# EAGLE design lcd1616 (EAGLE 5.11)
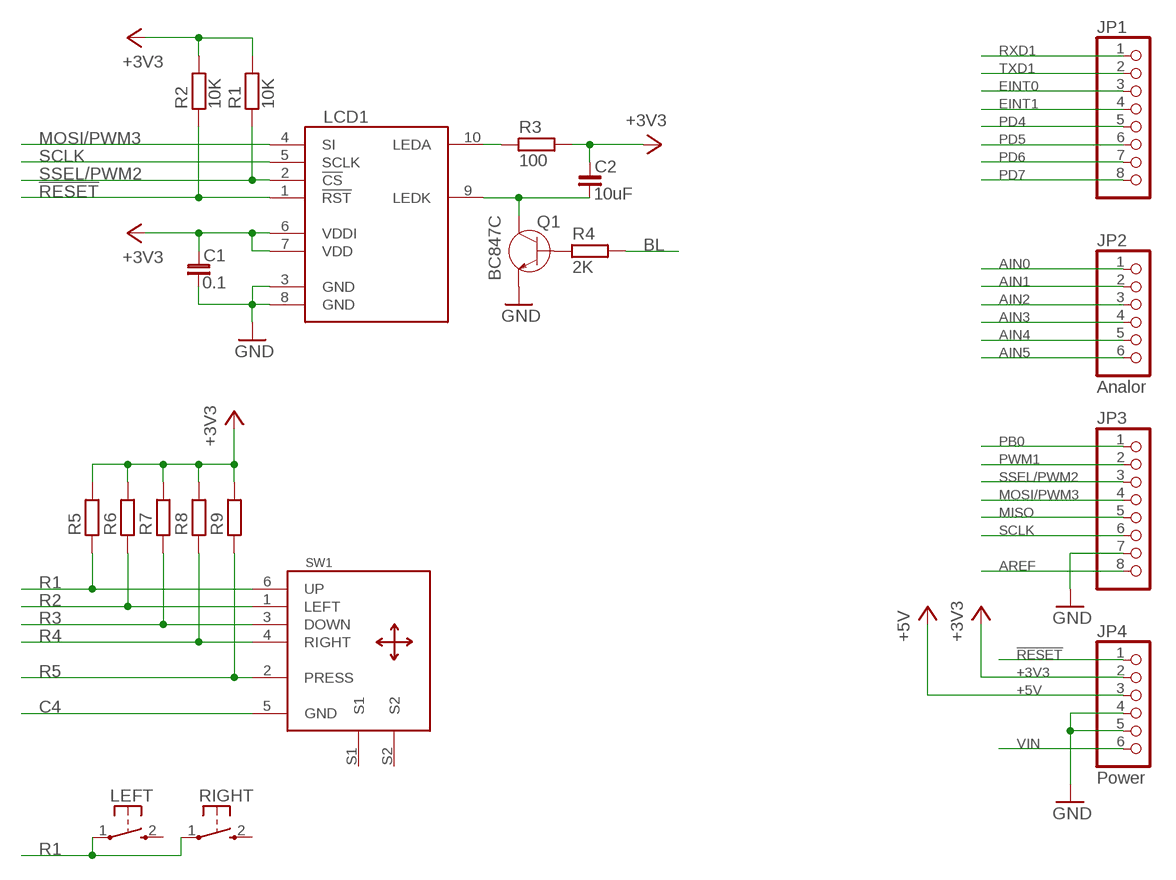
[diagram p0: schematic, sheet 1]

## Parts
C1  0.1  C_0603  [C0603]
C2  10uF  C_0805  [C0805]
JP1  PINHD-1X8_2.54  [1X08]
JP2  Analor  PINHD-1X6_2.54  [1X06]
JP3  PINHD-1X8_2.54  [1X08]
JP4  Power  PINHD-1X6_2.54  [1X06]
LCD1  NOKIA_LCD_1616  [NOKIA1616LCD]
LEFT  KSS-2EG4430  [KSS-2EG4430]
Q1  BC847C  [SOT23]
R1  10K  R_0603  [R0603]
R2  10K  R_0603  [R0603]
R3  100  R_0603  [R0603]
R4  2K  R_0603  [R0603]
R5  4.7K  R_0603  [R0603]
R6  4.7K  R_0603  [R0603]
R7  4.7K  R_0603  [R0603]
R8  4.7K  R_0603  [R0603]
R9  4.7K  R_0603  [R0603]
RIGHT  KSS-2EG4430  [KSS-2EG4430]
SW1  NOKIA-JOY  [NOKIA_JOY]

## Nets
!RESET: JP4.1 LCD1.1(!RST) R2.1
+3V3: C1.1 C2.1 JP4.2 LCD1.6(VDDI) LCD1.7(VDD) R1.2 R2.2 R3.2 R5.2 R6.2 R7.2 R8.2 R9.2
+5V: JP4.3
AIN0: JP2.1
AIN1: JP2.2
AIN2: JP2.3
AIN3: JP2.4
AIN4: JP2.5
AIN5: JP2.6
AREF: JP3.8
BL: R4.2
C4: SW1.5(GND)
EINT0: JP1.3
EINT1: JP1.4
GND: C1.2 JP3.7 JP4.4 JP4.5 LCD1.3(GND) LCD1.8(GND) Q1.2(E)
MISO: JP3.5
MOSI/PWM3: JP3.4 LCD1.4(SI)
N$7: C2.2 LCD1.9(LEDK) Q1.3(C)
N$8: LCD1.10(LEDA) R3.1
N$9: Q1.1(B) R4.1
PB0: JP3.1
PD4: JP1.5
PD5: JP1.6
PD6: JP1.7
PD7: JP1.8
PWM1: JP3.2
R1: LEFT.1(P) R5.1 RIGHT.1(P) SW1.6(UP)
R2: R6.1 SW1.1(LEFT)
R3: R7.1 SW1.3(DOWN)
R4: R8.1 SW1.4(RIGHT)
R5: R9.1 SW1.2(PRESS)
RXD1: JP1.1
SCLK: JP3.6 LCD1.5(SCLK)
SSEL/PWM2: JP3.3 LCD1.2(!CS) R1.1
TXD1: JP1.2
VIN: JP4.6
Unconnected: LEFT.2(S) RIGHT.2(S) SW1.S1 SW1.S2

## Library data of the parts
C1 C2 = rc-master-smd:C_: NON-POLARIZED CAP
JP1 JP3 = pinhead-fixdrills:PINHD-1X8: PIN HEADER
JP2 JP4 = pinhead-fixdrills:PINHD-1X6: PIN HEADER
LCD1 = nokia_lcd:NOKIA_LCD: 1.3" b/w graphics display 96x68 pixel. From Nokia 1202 cell phone 1.8" color graphics display 128x160 pixel. From Nokia 1616 cell phone
LEFT RIGHT = buttons:KSS-2EG4430: Size: 3x6mm Height: 5mm from PCB Rating: DC12v 50mA Travel: 0.25±0.10mm Operating Force: 180±50gf Return Force: 60gf min Contact resistance: 100m? max Insulation resistance: 100M? min Operating life?50,000 cycles
Q1 = semiconductor:BC847: Bipolar transistor NPN-structure
R1-R9 = rc-master-smd:R_: RESISTOR
SW1 = buttons:NOKIA-JOY: Nokia 3250/6820/N73 Joystick

## Board
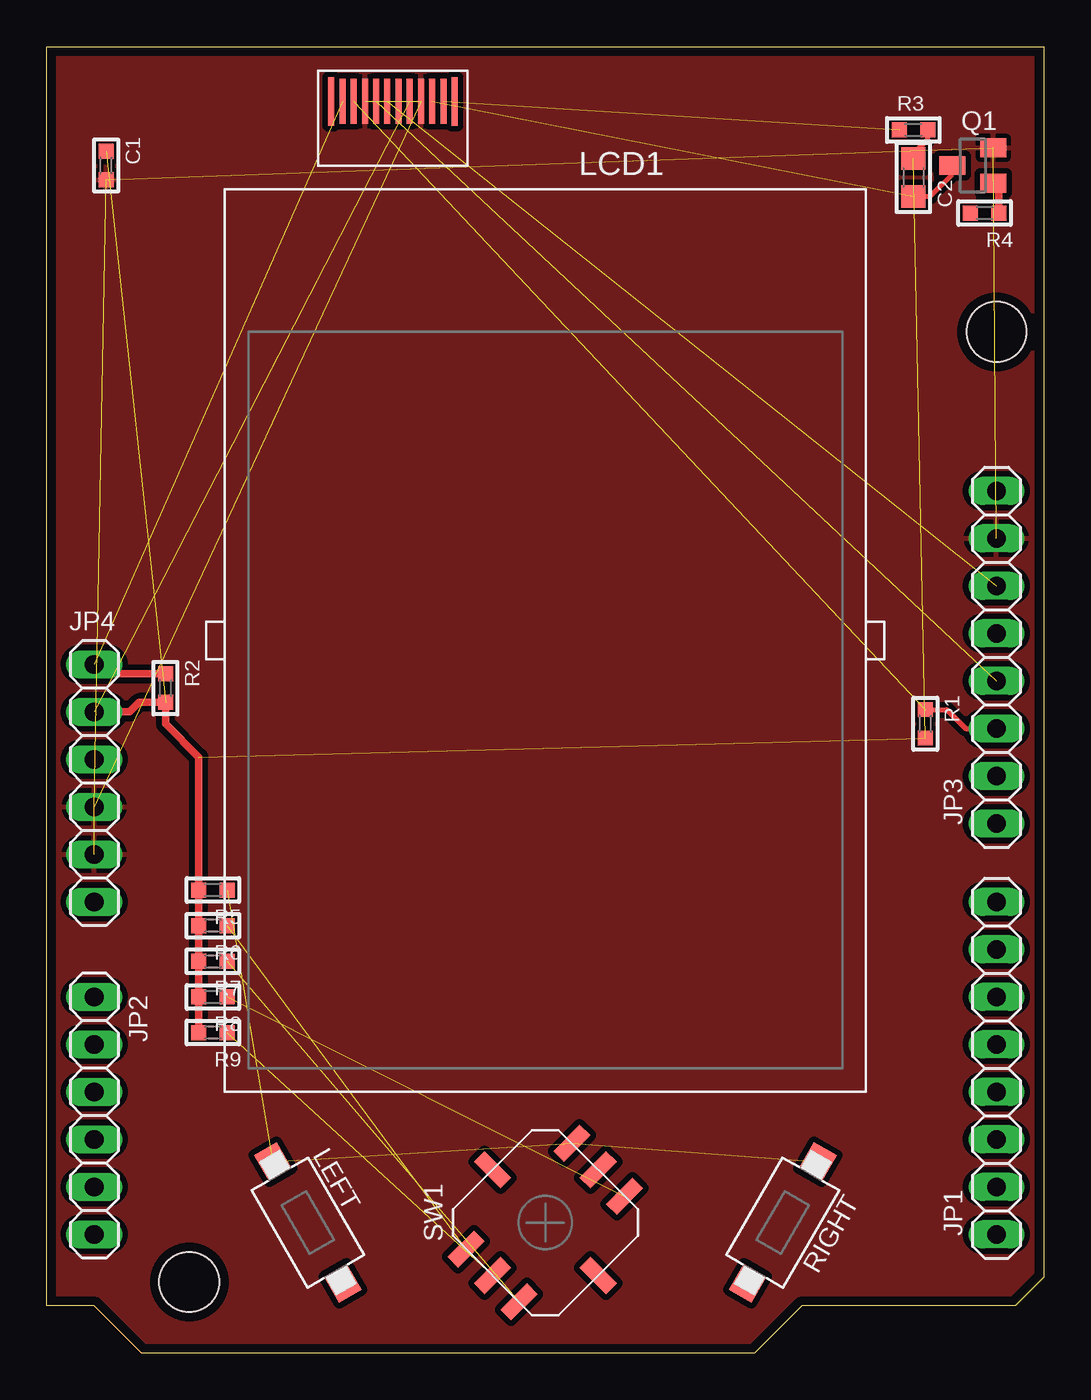
[diagram p1: board, top side]

Size 53.34 x 69.85 mm. Coordinates in mm from the lower left corner, seen from the top.
Outline: 53.34,69.85 53.34,4.06 51.82,2.54 40.39,2.54 37.85,0 5.08,0 2.54,2.54 0,2.54 0,69.85 53.34,69.85
Copper layers (1*16): Top 0.018mm / dielectric 1.5011mm / Bottom 0.018mm
Design rules "resonit-speed-18um": minimum track width 0.15mm, minimum drill 0.4mm, track to track 0.15mm, track to pad 0.15mm, pad to pad 0.15mm, via to via 0.15mm, smd to smd 0.15mm, copper to edge 0.5mm, drill to drill 8mil, minimum pad ring 0.25mm, minimum via ring 0.25mm, stop-mask expansion 4mil, vias tented up to drill 0.6mm, thermal gap 10mil
Holes 3.2 mm at 7.62,3.81 50.8,54.61

### Footprints (pad centres in the part's own frame; a part is rotated, then mirrored left to right if it is on the bottom)
C0603 = smd 0.8 x 0.8: 1 -0.762,0; 2 0.762,0
C0805 = smd 1.2 x 1.3: 1 -1.016,0; 2 1.016,0
1X08 = drill 1 long: 1 -8.89,0; 2 -6.35,0; 3 -3.81,0; 4 -1.27,0; 5 1.27,0; 6 3.81,0; 7 6.35,0; 8 8.89,0
1X06 = drill 1 long: 1 -6.35,0; 2 -3.81,0; 3 -1.27,0; 4 1.27,0; 5 3.81,0; 6 6.35,0
NOKIA1616LCD = smd 0.32 x 2.6: 0 -11.455,28.829; 11 -4.855,28.829 | smd 0.32 x 2.4: 1 -10.855,28.829; 2 -10.255,28.829; 3 -9.655,28.829; 4 -9.055,28.829; 5 -8.455,28.829; 6 -7.855,28.829; 7 -7.255,28.829; 8 -6.655,28.829; 9 -6.055,28.829; 10 -5.455,28.829
KSS-2EG4430 = smd 1.6 x 1.4: 1 -3.75,0; 2 3.75,0
SOT23 = smd 1 x 1.4: 1 -0.95,-1.1; 2 0.95,-1.1; 3 0,1.1
R0603 = smd 0.8 x 0.8: 1 -0.762,0; 2 0.762,0
NOKIA_JOY = smd 2 x 0.8 rotated 45: 1 -4.243,-1.414; 2 -2.828,-2.828; 3 -1.414,-4.243; 4 4.243,1.414; 5 2.828,2.828; 6 1.414,4.243 | smd 2 x 0.8 rotated 135: S1 -2.828,2.828; S2 2.828,-2.828

### Placement (x,y rotation side)
C1  3.17,63.5 270 top
C2  46.35,62.87 270 top
JP1  50.8,15.24 90 top
JP2  2.54,12.7 270 top
JP3  50.8,37.21 90 top
JP4  2.54,30.48 270 top
LCD1  26.67,38.1 0 top
LEFT  13.97,6.99 300 top
Q1  49.53,63.5 90 top
R1  46.99,33.66 270 top
R2  6.35,35.56 270 top
R3  46.35,65.41 0 top
R4  50.16,60.96 180 top
R5  8.89,24.77 180 top
R6  8.89,22.86 180 top
R7  8.89,20.95 180 top
R8  8.89,19.05 180 top
R9  8.89,17.14 180 top
RIGHT  39.37,6.99 240 top
SW1  26.67,6.99 0 top

### Tracks (layer width: path | path; a pad name or v marks a point on that pad's centre or on a via)
!RESET  (1 unrouted)
  Top 0.406: R2.1 3.05,36.32 JP4.1
+3V3  (5 unrouted)
  Top 0.254: C2.1 46.35,64.14 47.12,64.9 R3.2
  Top 0.406: R9.2 R8.2 R7.2 R6.2 R5.2 8.13,31.88 6.35,33.66 R2.2 4.95,34.8 4.45,34.29 JP4.2
GND  (6 unrouted)
  pour Top (isolate 0.305): -0.64,70.48 53.98,70.48 53.98,-0.64 -0.64,-0.64
MOSI/PWM3  (1 unrouted)
N$7  (1 unrouted)
  Top 0.254: C2.2 47.24,61.85 48.43,63.03 Q1.3
N$8  (1 unrouted)
N$9
  Top 0.406: R4.1 50.93,62.25 Q1.1
R1  (3 unrouted)
R2  (1 unrouted)
R3  (1 unrouted)
R4  (1 unrouted)
R5  (1 unrouted)
SCLK  (1 unrouted)
SSEL/PWM2  (1 unrouted)
  Top 0.254: R1.1 48.13,34.42 49.15,33.4 JP3.3